# Altium schematic sheet FilterBoard.Schematic.SchDoc
size B
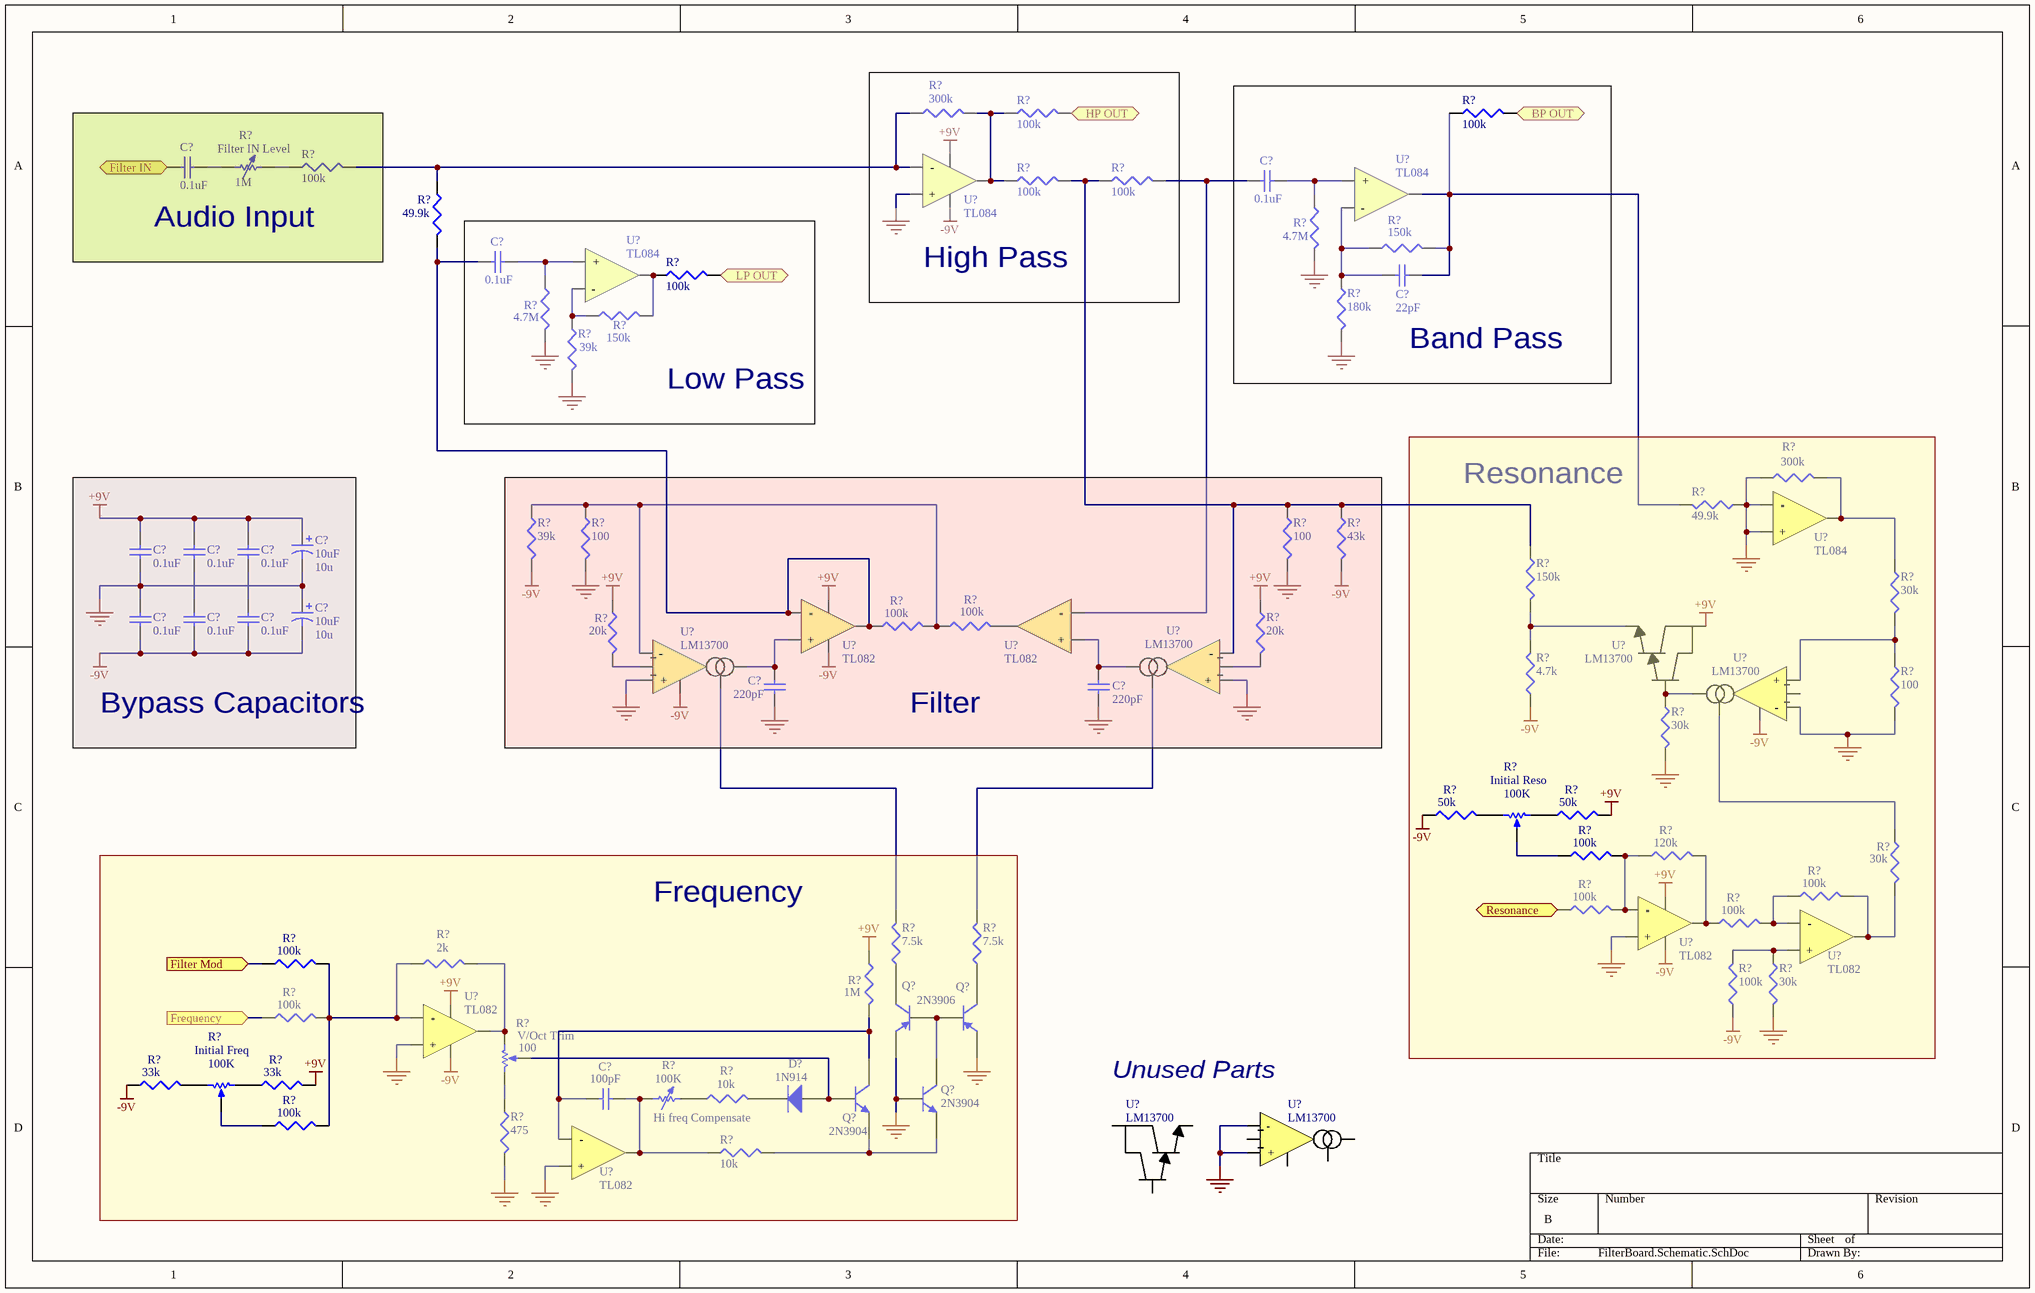
[diagram p0: FilterBoard.Schematic.SchDoc]

## Parts
(Parts that share a designator on the sheet are numbered #1, #2 ... from top to bottom, then left to right.)
C?#1  0.1uF  [C1206]
C?#2  0.1uF  [C1206]
C?#3  0.1uF  [C1206]
C?#4  22pF  [C1206]
C?#5  10uF  value 10u  [RB7.6-15]
C?#6  0.1uF  [C1206]
C?#7  0.1uF  [C1206]
C?#8  0.1uF  [C1206]
C?#9  10uF  value 10u  [RB7.6-15]
C?#10  0.1uF  [C1206]
C?#11  0.1uF  [C1206]
C?#12  0.1uF  [C1206]
C?#13  220pF  [C1206]
C?#14  220pF  [C1206]
C?#15  100pF  [C1206]
D?  1N914  [DO-41]
Q?#1  2N3906  [TO-92A]
Q?#2  2N3906  [TO-92A]  (value not drawn)
Q?#3  2N3904  [TO-92A]
Q?#4  2N3904  [TO-92A]
R?#1  300k  [J1-0603]
R?#2  100k  [J1-0603]
R?#3  100k  [J1-0603]
R?#4  Filter IN Level  value 1M  [AXIAL-0.7]
R?#5  100k  [J1-0603]
R?#6  100k  [J1-0603]
R?#7  100k  [J1-0603]
R?#8  49.9k  [J1-0603]
R?#9  4.7M  [J1-0603]
R?#10  150k  [J1-0603]
R?#11  100k  [J1-0603]
R?#12  4.7M  [J1-0603]
R?#13  180k  [J1-0603]
R?#14  150k  [J1-0603]
R?#15  39k  [J1-0603]
R?#16  300k  [J1-0603]
R?#17  39k  [J1-0603]
R?#18  100  [J1-0603]
R?#19  100  [J1-0603]
R?#20  43k  [J1-0603]
R?#21  49.9k  [J1-0603]
R?#22  150k  [J1-0603]
R?#23  30k  [J1-0603]
R?#24  20k  [J1-0603]
R?#25  100k  [J1-0603]
R?#26  100k  [J1-0603]
R?#27  20k  [J1-0603]
R?#28  100  [J1-0603]
R?#29  4.7k  [J1-0603]
R?#30  30k  [J1-0603]
R?#31  50k  [J1-0603]
R?#32  50k  [J1-0603]
R?#33  Initial Reso  value 100K  [VR5]
R?#34  100k  [J1-0603]
R?#35  120k  [J1-0603]
R?#36  30k  [J1-0603]
R?#37  100k  [J1-0603]
R?#38  100k  [J1-0603]
R?#39  100k  [J1-0603]
R?#40  100k  [J1-0603]
R?#41  2k  [J1-0603]
R?#42  7.5k  [J1-0603]
R?#43  1M  [J1-0603]
R?#44  7.5k  [J1-0603]
R?#45  30k  [J1-0603]
R?#46  100k  [J1-0603]
R?#47  100k  [J1-0603]
R?#48  V/Oct Trim  value 100  [VR5]
R?#49  33k  [J1-0603]
R?#50  33k  [J1-0603]
R?#51  Hi freq Compensate  value 100K  [AXIAL-0.7]
R?#52  10k  [J1-0603]
R?#53  Initial Freq  value 100K  [VR5]
R?#54  100k  [J1-0603]
R?#55  475  [J1-0603]
R?#56  10k  [J1-0603]
U?#1  TL084
U?#2  TL084
U?#3  TL084
U?#4  TL084
U?#5  TL082
U?#6  TL082
U?#7  LM13700
U?#8  LM13700
U?#9  LM13700
U?#10  LM13700
U?#11  TL082
U?#12  TL082
U?#13  TL082
U?#14  LM13700
U?#15  TL082
U?#16  LM13700

## Blocks framed on the sheet
Audio Input: C?#1 R?#4 R?#5
High Pass: R?#1 R?#2 R?#6 R?#7 U?#1
Band Pass: C?#2 C?#4 R?#3 R?#9 R?#10 R?#13 U?#2
Low Pass: C?#3 R?#11 R?#12 R?#14 R?#15 U?#3
Resonance: R?#16 R?#21-R?#23 R?#28-R?#39 R?#45 R?#47 U?#4 U?#9-U?#12
Bypass Capacitors: C?#5-C?#12
Filter: C?#13 C?#14 R?#17-R?#20 R?#24-R?#27 U?#5-U?#8
Frequency: C?#15 D? Q?#1-Q?#4 R?#40-R?#44 R?#46 R?#48-R?#56 U?#13 U?#15

## Ports
BP OUT (out), Filter IN (in), Filter Mod (in), Frequency (in), HP OUT (out), LP OUT (out), Resonance (in)

## Nets
+9V: C?#5.1 C?#6.2 C?#7.2 C?#8.2 R?#24.1 R?#27.1 R?#32.2 R?#43.1 R?#50.2 U?#1.4(VCC+) U?#5.8(VCC+) U?#9.11(V+) U?#11.8(VCC+) U?#13.8(VCC+)
-9V: C?#9.2 C?#10.1 C?#11.1 C?#12.1 R?#17.2 R?#20.2 R?#29.1 R?#31.1 R?#47.1 R?#49.1 U?#1.11(VCC-) U?#5.4(VCC-) U?#7.6(VCC-) U?#10.6(VCC-) U?#11.4(VCC-) U?#13.4(VCC-)
GND: C?#5.2 C?#6.1 C?#9.1 C?#10.2 C?#13.1 C?#14.1 Q?#1.1(E) Q?#2.1(E) Q?#4.2(B) R?#9.2 R?#12.2 R?#13.2 R?#15.2 R?#16.1 R?#18.2 R?#19.2 R?#21.1 R?#28.2 R?#30.2 R?#45.2 R?#55.2 U?#1.3(+) U?#4.12(-) U?#4.13(+) U?#7.3(+) U?#8.3(+) U?#10.3(-) U?#11.3(+) U?#13.3(+) U?#14.3(+) U?#14.4(-) U?#15.5(+)
BP OUT: R?#3.2 ; port BP OUT
Filter IN: C?#1.1 ; port Filter IN
Filter Mod: R?#40.1 ; port Filter Mod
Frequency: R?#46.1 ; port Frequency
HP OUT: R?#2.2 ; port HP OUT
LP OUT: R?#11.2 ; port LP OUT
Resonance: R?#38.1 ; port Resonance
NetC?#1_2: C?#1.2 R?#4.1
NetC?#2_1: C?#2.1 R?#7.2 U?#6.6(-)
NetC?#2_2: C?#2.2 R?#9.1 U?#2.5(+)
NetC?#3_1: C?#3.1 R?#8.2 R?#25.1 U?#5.1(OUT) U?#5.2(-)
NetC?#3_2: C?#3.2 R?#12.1 U?#3.5(+)
NetC?#4_1: C?#4.1 R?#10.1 R?#13.1 U?#2.3(-)
NetC?#4_2: C?#4.2 R?#3.1 R?#10.2 R?#21.2 U?#2.7(OUT)
NetC?#7_1: C?#7.1 C?#11.2
NetC?#8_1: C?#8.1 C?#12.2
NetC?#13_2: C?#13.2 U?#5.3(+) U?#7.5(OUT)
NetC?#14_2: C?#14.2 U?#6.5(+) U?#8.5(OUT)
NetC?#15_1: C?#15.1 Q?#3.3(C) R?#43.2 U?#15.6(-)
NetC?#15_2: C?#15.2 R?#51.1 R?#56.1 U?#15.7(OUT)
NetD?_1: D?.1(A) Q?#3.2(B) R?#48.3(TAP)
NetD?_2: D?.2(K) R?#52.2
NetQ?#1_2: Q?#1.2(B) Q?#2.2(B) Q?#4.3(C)
NetQ?#1_3: Q?#1.3(C) R?#42.1
NetQ?#2_3: Q?#2.3(C) R?#44.1
NetQ?#3_1: Q?#3.1(E) Q?#4.1(E) R?#56.2
NetR?#1_1: R?#1.1 R?#5.2 R?#8.1 U?#1.2(-)
NetR?#1_2: R?#1.2 R?#2.1 R?#6.1 U?#1.1(OUT)
NetR?#4_2: R?#4.2 R?#5.1
NetR?#6_2: R?#6.2 R?#7.1 R?#19.1 R?#20.1 R?#22.1 U?#8.4(-)
NetR?#11_1: R?#11.1 R?#14.2 U?#3.7(OUT)
NetR?#14_1: R?#14.1 R?#15.1 U?#3.3(-)
NetR?#16_2: R?#16.2 R?#23.1 U?#4.14(OUT)
NetR?#17_1: R?#17.1 R?#18.1 R?#25.2 R?#26.1 U?#7.4(-)
NetR?#22_2: R?#22.2 R?#29.2 U?#9.8(BOUT)
NetR?#23_2: R?#23.2 R?#28.1 U?#10.4(+)
NetR?#24_2: R?#24.2 U?#7.2
NetR?#26_2: R?#26.2 U?#6.7(OUT)
NetR?#27_2: R?#27.2 U?#8.2
NetR?#30_1: R?#30.1 U?#9.7(BIN) U?#10.5(OUT)
NetR?#31_2: R?#31.2 R?#33.2(BOT)
NetR?#32_1: R?#32.1 R?#33.1(TOP)
NetR?#33_3: R?#33.3(TAP) R?#34.1
NetR?#34_2: R?#34.2 R?#35.1 R?#38.2 U?#11.2(-)
NetR?#35_2: R?#35.2 R?#39.1 U?#11.1(OUT)
NetR?#36_1: R?#36.1 U?#10.1(BIAS)
NetR?#36_2: R?#36.2 R?#37.2 U?#12.7(OUT)
NetR?#37_1: R?#37.1 R?#39.2 U?#12.6(-)
NetR?#40_2: R?#40.2 R?#41.1 R?#46.2 R?#54.2 U?#13.2(-)
NetR?#41_2: R?#41.2 R?#48.1(TOP) U?#13.1(OUT)
NetR?#42_2: R?#42.2 U?#7.1(BIAS)
NetR?#44_2: R?#44.2 U?#8.1(BIAS)
NetR?#45_1: R?#45.1 R?#47.2 U?#12.5(+)
NetR?#48_2: R?#48.2(BOT) R?#55.1
NetR?#49_2: R?#49.2 R?#53.2(BOT)
NetR?#50_1: R?#50.1 R?#53.1(TOP)
NetR?#51_2: R?#51.2 R?#52.1
NetR?#53_3: R?#53.3(TAP) R?#54.1

Not connected (* = marked no-connect by the designer): U?#2 6(VCC+) 11(VCC-); U?#3 6(VCC+) 11(VCC-); U?#4 1(VCC+) 11(VCC-); U?#6 4(VCC-) 8(VCC+); U?#8 6(VCC-); U?#10 2; U?#12 4(VCC-) 8(VCC+); U?#14 1(BIAS) 2 5(OUT) 6(VCC-); U?#15 4(VCC-) 8(VCC+); U?#16 7(BIN) 8(BOUT) 11(V+)

## Notes on the sheet
- (near U?#16) Unused Parts

## Library data of the parts
C?#1-C?#3 C?#6-C?#8 C?#10-C?#12 = Cap Semi: Capacitor (Semiconductor SIM Model); Value: 0.1u; Published: 8-Jun-2000; LatestRevisionDate: 29-May-2009; LatestRevisionNote: IPC-7351 Footprint Added.; PackageReference: C1206; Publisher: Altium Limited; PackageDescription: Chip Capacitor
C?#4 = Cap Semi: Capacitor (Semiconductor SIM Model); Value: 22p; Published: 8-Jun-2000; LatestRevisionDate: 29-May-2009; LatestRevisionNote: IPC-7351 Footprint Added.; PackageReference: C1206; Publisher: Altium Limited; PackageDescription: Chip Capacitor
C?#5 C?#9 = Cap Pol1: Polarized Capacitor (Radial); Published: 8-Jun-2000; LatestRevisionDate: 17-Jul-2002; LatestRevisionNote: Re-released for DXP Platform.; PackageReference: RB7.6-15; Publisher: Altium Limited; PackageDescription: Polarized Capacitor (Radial); 2 Leads
C?#13 C?#14 = Cap Semi: Capacitor (Semiconductor SIM Model); Value: 220p; Published: 8-Jun-2000; LatestRevisionDate: 29-May-2009; LatestRevisionNote: IPC-7351 Footprint Added.; PackageReference: C1206; Publisher: Altium Limited; PackageDescription: Chip Capacitor
C?#15 = Cap Semi: Capacitor (Semiconductor SIM Model); Value: 100p; Published: 8-Jun-2000; LatestRevisionDate: 29-May-2009; LatestRevisionNote: IPC-7351 Footprint Added.; PackageReference: C1206; Publisher: Altium Limited; PackageDescription: Chip Capacitor
D? = Diode 1N4001: 1 Amp General Purpose Rectifier; Published: 8-Jun-2000; LatestRevisionDate: 17-Jul-2002; LatestRevisionNote: Re-released for DXP Platform.; DatasheetVersion: 1998; PackageVersion: Aug-1999; PackageReference: DO-41; Publisher: Altium Limited; PackageDescription: Diode, Axial; Body 5.2 x 2.7 mm (LxDia. max), Lead Dia. 0.86 mm (max); Code_JEDEC: DO-204-AL; ComponentLink1Description: Manufacturer Link; ComponentLink1URL: http://www.fairchildsemi.com/; ComponentLink2Description: Datasheet; ComponentLink2URL: http://www.fairchildsemi.com/ds/1N%2F1N4001.pdf
Q?#1 Q?#2 = 2N3906: PNP General Purpose Amplifier; Published: 8-Jun-2000; LatestRevisionDate: 15-Jan-2003; LatestRevisionNote: PCB Footprint 'BCY-W3/D4.7' replaced; DatasheetVersion: 1997; PackageVersion: Sep-1998; PackageReference: TO-92A; Publisher: Altium Limited; PackageDescription: TO, Flat Index; 3 In-Line, Axial Leads; Body Dia. 4.5mm; Leads 0.51 x 0.48 mm (max); ComponentLink1Description: Manufacturer Link; ComponentLink1URL: http://www.fairchildsemi.com/; ComponentLink2Description: Datasheet; ComponentLink2URL: http://www.fairchildsemi.com/ds/2N%2F2N3906.pdf
Q?#3 Q?#4 = 2N3904: NPN General Purpose Amplifier; Published: 8-Jun-2000; LatestRevisionDate: 15-Jan-2003; LatestRevisionNote: PCB Footprint 'BCY-W3/D4.7' replaced; DatasheetVersion: 1997; PackageVersion: Sep-1998; PackageReference: TO-92A; Publisher: Altium Limited; PackageDescription: TO, Flat Index; 3 In-Line, Axial Leads; Body Dia. 4.5mm; Leads 0.51 x 0.48 mm (max); ComponentLink1Description: Manufacturer Link; ComponentLink1URL: http://www.fairchildsemi.com/; ComponentLink2Description: Datasheet; ComponentLink2URL: http://www.fairchildsemi.com/ds/2N%2F2N3904.pdf
R?#1-R?#3 R?#5-R?#32 R?#34-R?#47 R?#49 R?#50 R?#52 R?#54-R?#56 = Res3: Resistor; Published: 8-Jun-2000; LatestRevisionDate: 29-May-2009; LatestRevisionNote: IPC-7351 Footprint Added.; PackageReference: J1-0603; Publisher: Altium Limited; PackageDescription: Chip Resistor
  R?#1 R?#16: Value: 300K
  R?#2 R?#3 R?#5-R?#7 R?#11 R?#25 R?#26 R?#34 R?#37-R?#40 R?#46 R?#47 R?#54: Value: 100K
  R?#8 R?#21: Value: 49.9K
  R?#9 R?#12: Value: 4.7M
  R?#10 R?#14 R?#22: Value: 150K
  R?#13: Value: 180K
  R?#15 R?#17: Value: 39K
  R?#18 R?#19 R?#28: Value: 100
  R?#20: Value: 43K
  R?#23 R?#30 R?#36 R?#45: Value: 30K
  R?#24 R?#27: Value: 20K
  R?#29: Value: 4.7K
  R?#31 R?#32: Value: 50K
  R?#35: Value: 120K
  R?#41: Value: 2K
  R?#42 R?#44: Value: 7.5K
  R?#43: Value: 1M
  R?#49 R?#50: Value: 33K
  R?#52 R?#56: Value: 10K
  R?#55: Value: 475
R?#4 R?#51 = Res Adj1: Variable Resistor; Set Position: 0.5; Published: 8-Jun-2000; LatestRevisionDate: 17-Jul-2002; LatestRevisionNote: Re-released for DXP Platform.; PackageReference: AXIAL-0.7; Publisher: Altium Limited; PackageDescription: Axial Device, Thru-Hole; 2 Leads; 0.7 in Pin Spacing
R?#33 R?#48 R?#53 = RPot: Potentiometer; Sim Note: Enter the Resistance value and the set point into parameter fields.; Set Position: 0.5; Published: 8-Jun-2000; LatestRevisionDate: 17-Jul-2002; LatestRevisionNote: Re-released for DXP Platform.; PackageReference: VR5; Publisher: Altium Limited; PackageDescription: Variable Resistor, Thru-Hole; 3 Leads
U?#9 U?#16 = LM13700_1